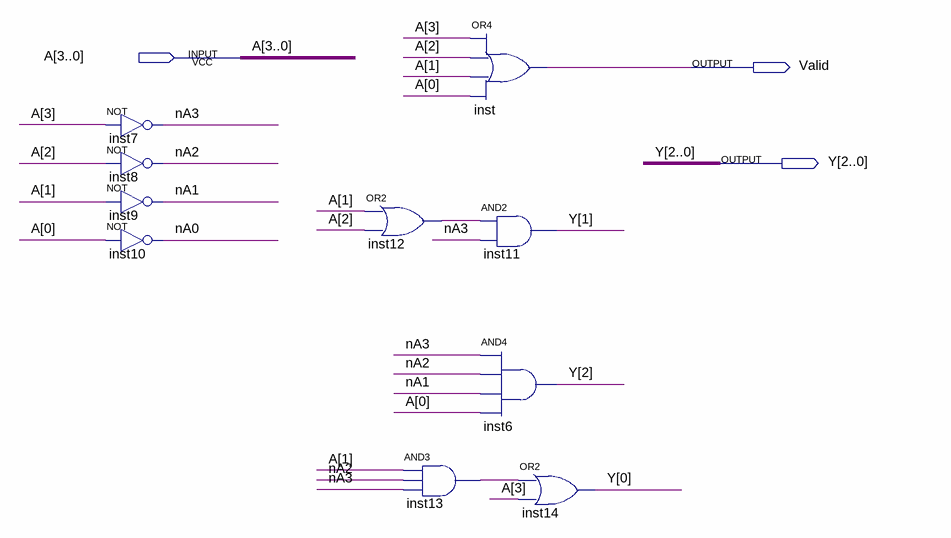
[diagram p0: schematic sheet]
// Quartus schematic Encoder.bdf as structural Verilog: 10 symbols, 3 pins
module Encoder (
  input  [3:0] A,
  output Valid,
  output [2:0] Y
);

  wire inst12_out, inst13_out, nA0, nA1, nA2, nA3;

  not inst7 (nA3, A[3]);
  not inst8 (nA2, A[2]);
  not inst9 (nA1, A[1]);
  not inst10 (nA0, A[0]);
  or inst12 (inst12_out, A[1], A[2]);
  and inst13 (inst13_out, A[1], nA2, nA3);
  or inst (Valid, A[3], A[2], A[1], A[0]);
  and inst11 (Y[1], inst12_out, nA3);
  and inst6 (Y[2], nA3, nA2, nA1, A[0]);
  or inst14 (Y[0], inst13_out, A[3]);
endmodule
